# EAGLE design pcb_all (EAGLE 9.6.2)
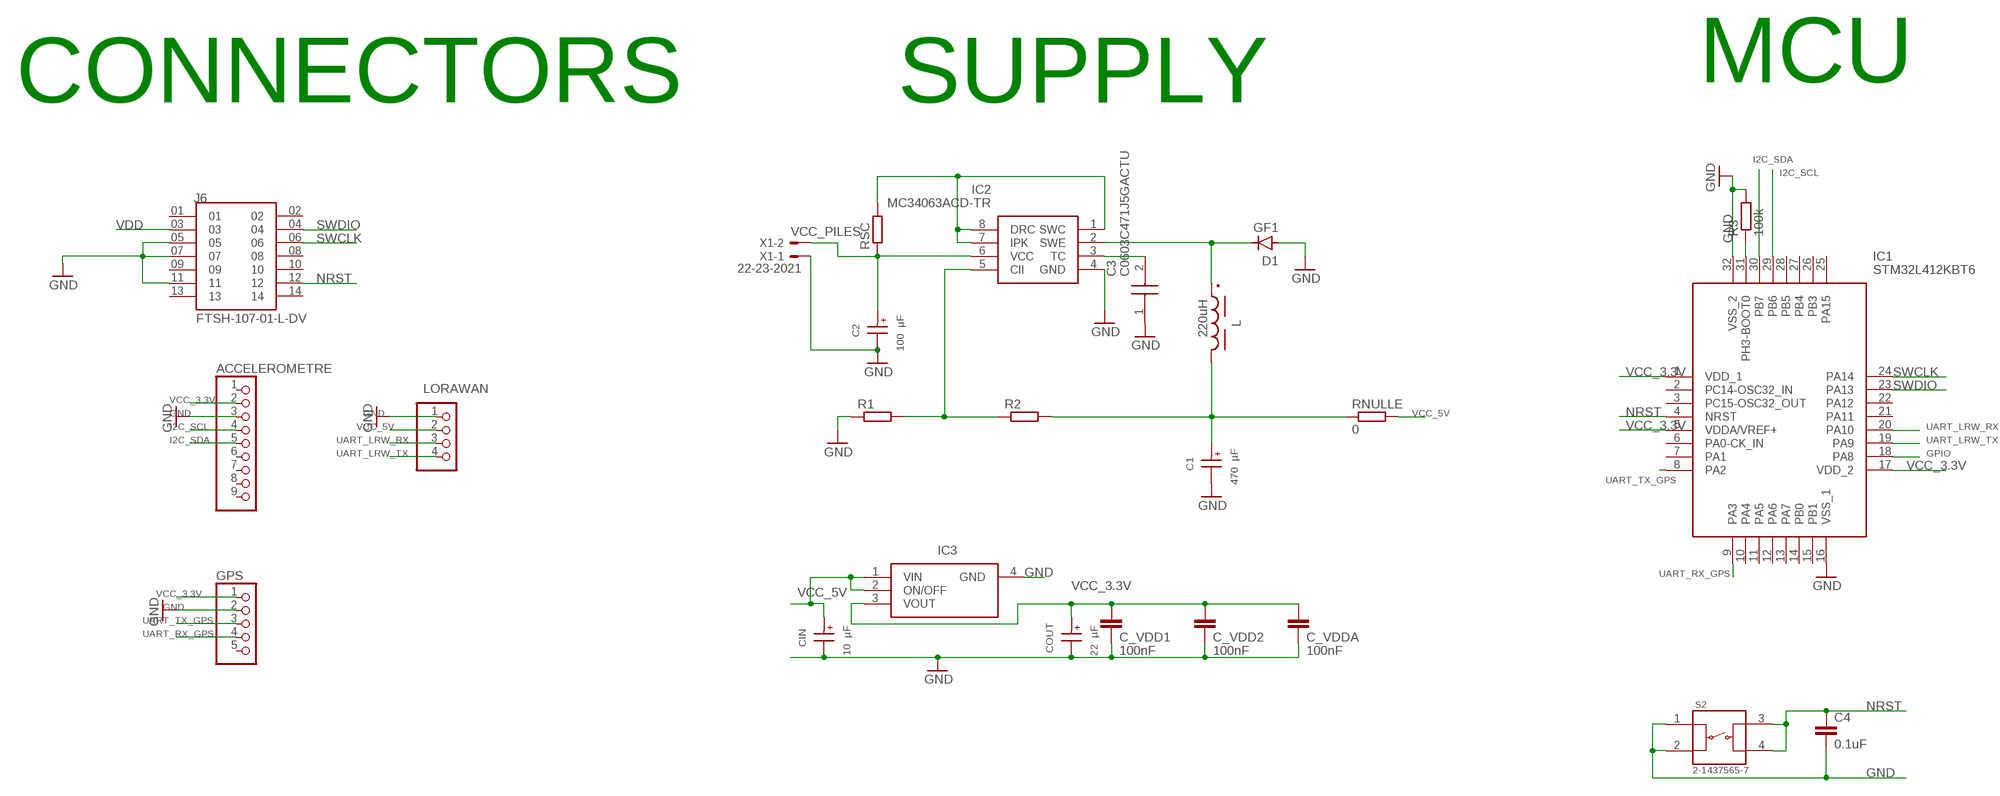
[diagram p0: schematic, sheet 1]

## Parts
ACCELEROMETRE  PINHD-1X9  [1X09]
C1  470 µF  WCAP-ASLL_8X10.5_865060353009  [WCAP-ASLL_8X10.5(DXL)]
C2  100 µF  WCAP-ASLL_6.3X7.7_865060445005  [WCAP-ASLL_6.3X7.7(DXL)]
C3  C0603C471J5GACTU  [C0603]
C4  0.1uF  C-EUC0603  [C0603]
C_VDD1  100nF  C-EUC0603  [C0603]
C_VDD2  100nF  C-EUC0603  [C0603]
C_VDDA  100nF  C-EUC0603  [C0603]
CIN  10 µF  WCAP-ASLL_4X5.5_865060440001  [WCAP-ASLL_4X5.5(DXL)]
COUT  22 µF  WCAP-ASLL_5X5.5_865060442002  [WCAP-ASLL_5X5.5(DXL)]
D1  GF1  [SMA-DO214AC]
GPS  PINHD-1X5  [1X05]
IC1  STM32L412KBT6  [QFP80P900X900X160-32N]
IC2  MC34063ACD-TR  [SOIC127P600X175-8N]
IC3  NCV33375ST3.3T3G  [SOT230P700X175-4N]
J6  FTSH-107-01-L-DV  [SAMTEC_FTSH-107-01-L-DV]
L  220uH  WE-PDA_1260_784771221  [WE-PDA_1260]
LORAWAN  PINHD-1X4  [1X04]
R1  R-EU_R0603  [R0603]
R2  R-EU_R0603  [R0603]
R3  100k  R-EU_R0603  [R0603]
RNULLE  0  R-EU_R0603  [R0603]
RSC  R-EU_R1206W  [R1206W]
S2  2-1437565-7  [SW_2-1437565-7]
X1  22-23-2021  [22-23-2021]

## Nets
GND: ACCELEROMETRE.3 C1.2(-) C2.2(-) C3.1 C4.2 C_VDD1.2 C_VDD2.2 C_VDDA.2 CIN.2(-) COUT.2(-) D1.A GPS.2 IC1.16(VSS_1) IC1.32(VSS_2) IC2.4(GND) IC3.4(GND) J6.05 J6.07 J6.11 LORAWAN.1 R1.1 R3.2 S2.1 S2.2 X1.1
GPIO: IC1.18(PA8)
I2C_SCL: ACCELEROMETRE.4 IC1.29(PB6)
I2C_SDA: ACCELEROMETRE.5 IC1.30(PB7)
N$1: C1.1(+) L.2 R2.2 RNULLE.1
N$2: IC2.1(SWC) IC2.7(IPK) IC2.8(DRC) RSC.2
N$3: IC2.5(CII) R1.2 R2.1
N$4: IC1.31(PH3-BOOT0) R3.1
N$6: D1.K(C) IC2.2(SWE) L.1
N$7: C3.2 IC2.3(TC)
NRST: C4.1 IC1.4(NRST) J6.12 S2.3 S2.4
SWCLK: IC1.24(PA14) J6.06
SWDIO: IC1.23(PA13) J6.04
UART_LRW_RX: IC1.20(PA10) LORAWAN.3
UART_LRW_TX: IC1.19(PA9) LORAWAN.4
UART_RX_GPS: GPS.4 IC1.9(PA3)
UART_TX_GPS: GPS.3 IC1.8(PA2)
VCC_3.3V: ACCELEROMETRE.2 C_VDD1.1 C_VDD2.1 C_VDDA.1 COUT.1(+) GPS.1 IC1.1(VDD_1) IC1.5(VDDA/VREF+) IC1.17(VDD_2) IC3.3(VOUT)
VCC_5V: CIN.1(+) IC3.1(VIN) IC3.2(ON/OFF) LORAWAN.2 RNULLE.2
VCC_PILES: C2.1(+) IC2.6(VCC) RSC.1 X1.2
VDD: J6.03
Unconnected: ACCELEROMETRE.1 ACCELEROMETRE.6 ACCELEROMETRE.7 ACCELEROMETRE.8 ACCELEROMETRE.9 GPS.5 IC1.2(PC14-OSC32_IN) IC1.3(PC15-OSC32_OUT) IC1.6(PA0-CK_IN) IC1.7(PA1) IC1.10(PA4) IC1.11(PA5) IC1.12(PA6) IC1.13(PA7) IC1.14(PB0) IC1.15(PB1) IC1.21(PA11) IC1.22(PA12) IC1.25(PA15) IC1.26(PB3) IC1.27(PB4) IC1.28(PB5) J6.01 J6.02 J6.08 J6.09 J6.10 J6.13 J6.14

## Notes on the sheet
- CONNECTORS | SUPPLY | MCU

## Library data of the parts
ACCELEROMETRE = pinhead:PINHD-1X9: PIN HEADER
C1 = C1:WCAP-ASLL_8X10.5: WCAP-ASLL Aluminium Electrolytic Capacitors Low Impedance & Long Life +105 °C Characteristics Low impedance and long life product series Mounting style: V-Chip SMT Capacitance range: 1 µF ‒ 6800 µF Capacitance tolerance: ±20 % Voltage range (UR): 6.3 ‒ 450 V(DC) Operating temperature: -55 °C up to +105 °C for UR ≤ 100 V(DC) -40 °C up to +105 °C for UR > 100 V(DC) Endurance: 2000 ‒ 5000 h @ +105 °C Dimensions (DxL) in mm: 4.0 x 5.5 up to 16.0 x 17.0 Recommended soldering: Reflow soldering Applications Long life application & low impedance Input and output capacitor for switched-mode power supply Filtering Smoothing e.g. DC/DC converter, AC/DC converter, satellite receiver, control panel <https://www.we-online.com/catalog/media/o14724v209%20Family_WCAP-ASLL.jpg> Details see: https://www.we-online.com/catalog/en/WCAP-ASLL/ Updated by yingchun,Shan;2020-03-03 2020(C) Würth Elektronik; DATASHEET-URL: https://www.we-online.com/catalog/datasheet/865060353009.pdf; DF: 16%; DIAMETER: 8mm; I-LEAK: 75.2uA; I-RIPPLE: 600mA; L: 10.5mm; OPERATING-TEMPERATURE: -55 °C up to +105 °C; PART-NUMBER: 865060353009; TECHNICAL-REFERENCE: ASEE105471M016DVCTEE000; VR: 16V(DC); Z: 0.17Ohm
C2 = C2:WCAP-ASLL_6.3X7.7: WCAP-ASLL Aluminium Electrolytic Capacitors Low Impedance & Long Life +105 °C Characteristics Low impedance and long life product series Mounting style: V-Chip SMT Capacitance range: 1 µF ‒ 6800 µF Capacitance tolerance: ±20 % Voltage range (UR): 6.3 ‒ 450 V(DC) Operating temperature: -55 °C up to +105 °C for UR ≤ 100 V(DC) -40 °C up to +105 °C for UR > 100 V(DC) Endurance: 2000 ‒ 5000 h @ +105 °C Dimensions (DxL) in mm: 4.0 x 5.5 up to 16.0 x 17.0 Recommended soldering: Reflow soldering Applications Long life application & low impedance Input and output capacitor for switched-mode power supply Filtering Smoothing e.g. DC/DC converter, AC/DC converter, satellite receiver, control panel <https://www.we-online.com/catalog/media/o14724v209%20Family_WCAP-ASLL.jpg> Details see: https://www.we-online.com/catalog/en/WCAP-ASLL/ Updated by yingchun,Shan;2020-03-03 2020(C) Würth Elektronik; DATASHEET-URL: https://www.we-online.com/catalog/datasheet/865060445005.pdf; DF: 14%; DIAMETER: 6.3mm; I-LEAK: 25uA; I-RIPPLE: 300mA; L: 7.7mm; OPERATING-TEMPERATURE: -55 °C up to +105 °C; PART-NUMBER: 865060445005; TECHNICAL-REFERENCE: ASED077101M025DVCTCB000; VR: 25V(DC); Z: 0.36Ohm
C3 = C0603C471J5GACTU:C0603C471J5GACTU: SMD Comm C0G, Ceramic, 470 pF, 5%, 50 VDC, 125 VDC, 125?C, -55?C, C0G, SMD, MLCC, Ultra-Stable, Low Loss, Class I, 0.1 % , 100 GOhms, 3.7 mg, 0603, 1.6mm, 0.8mm, 0.8mm, 0.7mm, 0.35mm, 4000, 78 Weeks, 120 Source: Datasheet <https://content.kemet.com/datasheets/KEM_C1003_C0G_SMD.pdf>; ARROW_PART_NUMBER: C0603C471J5GACTU; ARROW_PRICE-STOCK: https://www.arrow.com/en/products/c0603c471j5gactu/kemet-corporation?region=nac; DESCRIPTION: SMD Comm C0G, Ceramic, 470 pF, 5%, 50 VDC, 125 VDC, 125?C, -55?C, C0G, SMD, MLCC, Ultra-Stable, Low Loss, Class I, 0.1 % , 100 GOhms, 3.7 mg, 0603, 1.6mm, 0.8mm, 0.8mm, 0.7mm, 0.35mm, 4000, 78 Weeks, 120; HEIGHT: 0.87mm; MANUFACTURER_NAME: KEMET; MANUFACTURER_PART_NUMBER: C0603C471J5GACTU; MOUSER_PART_NUMBER: 80-C0603C471J5G; MOUSER_PRICE-STOCK: https://www.mouser.co.uk/ProductDetail/KEMET/C0603C471J5GACTU?qs=6Zy9Yzz7FWCvDjERNKhvPg%3D%3D
C4 C_VDD1 C_VDD2 C_VDDA = rcl:C-EU: CAPACITOR, European symbol; SPICEPREFIX: C
CIN = Cin:WCAP-ASLL_4X5.5: WCAP-ASLL Aluminium Electrolytic Capacitors Low Impedance & Long Life +105 °C Characteristics Low impedance and long life product series Mounting style: V-Chip SMT Capacitance range: 1 µF ‒ 6800 µF Capacitance tolerance: ±20 % Voltage range (UR): 6.3 ‒ 450 V(DC) Operating temperature: -55 °C up to +105 °C for UR ≤ 100 V(DC) -40 °C up to +105 °C for UR > 100 V(DC) Endurance: 2000 ‒ 5000 h @ +105 °C Dimensions (DxL) in mm: 4.0 x 5.5 up to 16.0 x 17.0 Recommended soldering: Reflow soldering Applications Long life application & low impedance Input and output capacitor for switched-mode power supply Filtering Smoothing e.g. DC/DC converter, AC/DC converter, satellite receiver, control panel <https://www.we-online.com/catalog/media/o14724v209%20Family_WCAP-ASLL.jpg> Details see: https://www.we-online.com/catalog/en/WCAP-ASLL/ Updated by yingchun,Shan;2020-03-03 2020(C) Würth Elektronik; DATASHEET-URL: https://www.we-online.com/catalog/datasheet/865060440001.pdf; DF: 14%; DIAMETER: 4mm; I-LEAK: 3uA; I-RIPPLE: 90mA; L: 5.5mm; OPERATING-TEMPERATURE: -55 °C up to +105 °C; PART-NUMBER: 865060440001; TECHNICAL-REFERENCE: ASEB055100M025DVCTAB000; VR: 25V(DC); Z: 1.35Ohm
COUT = Cout:WCAP-ASLL_5X5.5: WCAP-ASLL Aluminium Electrolytic Capacitors Low Impedance & Long Life +105 °C Characteristics Low impedance and long life product series Mounting style: V-Chip SMT Capacitance range: 1 µF ‒ 6800 µF Capacitance tolerance: ±20 % Voltage range (UR): 6.3 ‒ 450 V(DC) Operating temperature: -55 °C up to +105 °C for UR ≤ 100 V(DC) -40 °C up to +105 °C for UR > 100 V(DC) Endurance: 2000 ‒ 5000 h @ +105 °C Dimensions (DxL) in mm: 4.0 x 5.5 up to 16.0 x 17.0 Recommended soldering: Reflow soldering Applications Long life application & low impedance Input and output capacitor for switched-mode power supply Filtering Smoothing e.g. DC/DC converter, AC/DC converter, satellite receiver, control panel <https://www.we-online.com/catalog/media/o14724v209%20Family_WCAP-ASLL.jpg> Details see: https://www.we-online.com/catalog/en/WCAP-ASLL/ Updated by yingchun,Shan;2020-03-03 2020(C) Würth Elektronik; DATASHEET-URL: https://www.we-online.com/catalog/datasheet/865060442002.pdf; DF: 14%; DIAMETER: 5mm; I-LEAK: 5.5uA; I-RIPPLE: 150mA; L: 5.5mm; OPERATING-TEMPERATURE: -55 °C up to +105 °C; PART-NUMBER: 865060442002; TECHNICAL-REFERENCE: ASEC055220M025DVCTBB000; VR: 25V(DC); Z: 0.8Ohm
D1 = diode:GF1: DIODE
GPS = pinhead:PINHD-1X5: PIN HEADER
IC1 = STM32_librairy:STM32L412KBT6: ARM Microcontrollers - MCU Ultra-low-power Arm Cortex -M4 32-bit MCU+FPU, 100DMIPS up to 128KB Flash, 40KB SRAM, analog, ext. SMPS Source: Datasheet; DESCRIPTION: ARM Microcontrollers - MCU Ultra-low-power Arm Cortex -M4 32-bit MCU+FPU, 100DMIPS up to 128KB Flash, 40KB SRAM, analog, ext. SMPS; HEIGHT: 1.6mm; MANUFACTURER_NAME: STMicroelectronics; MANUFACTURER_PART_NUMBER: STM32L412KBT6; MOUSER_PART_NUMBER: 511-STM32L412KBT6; MOUSER_PRICE-STOCK: https://www.mouser.co.uk/ProductDetail/STMicroelectronics/STM32L412KBT6?qs=%252BEew9%252B0nqrD6o08jV%2F00TA%3D%3D
IC2 = SamacSys_Parts:MC34063ACD-TR: MC34063ACD-TR, DC-DC Controller, 40 V, 8-Pin, SOIC Source: Datasheet <http://www.st.com/st-web-ui/static/active/en/resource/technical/document/datasheet/CD00001232.pdf>; DESCRIPTION: MC34063ACD-TR, DC-DC Controller, 40 V, 8-Pin, SOIC; HEIGHT: 1.75mm; MANUFACTURER_NAME: STMicroelectronics; MANUFACTURER_PART_NUMBER: MC34063ACD-TR; MOUSER_PART_NUMBER: 511-MC34063ACD-TR; MOUSER_PRICE-STOCK: https://www.mouser.co.uk/ProductDetail/STMicroelectronics/MC34063ACD-TR?qs=zDcCjb1ShEnlEhOFqqejBw%3D%3D
IC3 = SamacSys_Parts:NCV33375ST3.3T3G: ON SEMICONDUCTOR - NCV33375ST3.3T3G - Fixed LDO Voltage Regulator, 4.3V to 13V, 260mV Dropout, 3.3Vout, 300mAout, SOT-223-4 Source: Datasheet <http://www.onsemi.com/pub/Collateral/MC33375-D.PDF>; DESCRIPTION: ON SEMICONDUCTOR - NCV33375ST3.3T3G - Fixed LDO Voltage Regulator, 4.3V to 13V, 260mV Dropout, 3.3Vout, 300mAout, SOT-223-4; HEIGHT: 1.75mm; MANUFACTURER_NAME: onsemi; MANUFACTURER_PART_NUMBER: NCV33375ST3.3T3G; MOUSER_PART_NUMBER: 863-NCV33375ST3.3T3G; MOUSER_PRICE-STOCK: https://www.mouser.co.uk/ProductDetail/ON-Semiconductor/NCV33375ST33T3G?qs=Pqj8oIac8rWOl%252BM3OwXrOg%3D%3D
J6 = FTSH-107-01-L-DV:FTSH-107-01-L-DV; MANUFACTURER: Samtec; PARTREV: R; STANDARD: Manufacturer Recommendations
L = L:WE-PDA_1260: WE-PDA SMD Shielded Power Inductor Characteristics Magnetically shielded version which results in a low leakage field High storage capacity High Saturation currents up to 23 A Very low self-losses at high switching frequency's Wide inductance spectrum available at all sizes Operating Temperature -40 °C up to +125 °C Core Material: NiZn Wire connection: welding technology Applications Multimedia applications Switching regulators with low operating voltages Integrated DC/DC-converter Perfect suitable for switching regulators with extremely high efficiency (> 86 %) Plastic base: Because of the one piece construction these are more suitable for high vibration or shock applications <https://www.we-online.com/catalog/media/o55118v209%20Family_WE-PDA.jpg> Details see: https://www.we-online.com/katalog/en/WE-PDA Updated by Ella Wu 2020-03-18 2020(C) Wurth Elektronik; DATASHEET-URL: https://www.we-online.com/catalog/datasheet/784771221.pdf; FRES: 3.9MHz; IR: 0.99A; ISAT: 1.1A; MOUNT: SMT; PART-NUMBER: 784771221; RDC-MAX: 348mOhm; RDC-TYP: 290mOhm
LORAWAN = pinhead:PINHD-1X4: PIN HEADER
R1-R3 RNULLE RSC = rcl:R-EU_: RESISTOR, European symbol; SPICEPREFIX: R
S2 = 2-1437565-7:2-1437565-7: FSM2JSMA=SMT,TACTILE,PB SWITCH Check availability <https://pricing.snapeda.com/parts/FSM2JSMA/TE%20Connectivity/view-part?ref=eda>; AVAILABILITY: In Stock; COMMENT: 2-1437565-7; CONFIGURATION_POLE-THROW: Single Pole - Single Throw; CONTACT_CURRENT_RATING: 50 mA; DESCRIPTION: Tactile Switch SPST-NO Top Actuated Surface Mount; MF: TE Connectivity; MP: FSM2JSMA; PACKAGE: None; PRICE: None; PURCHASE-URL: https://pricing.snapeda.com/search/part/FSM2JSMA/?ref=eda
X1 = con-molex:22-23-2021: .100" (2.54mm) Center Header - 2 Pin; MF: MOLEX; MPN: 22-23-2021; OC_FARNELL: 1462926; OC_NEWARK: 25C3832

## Board
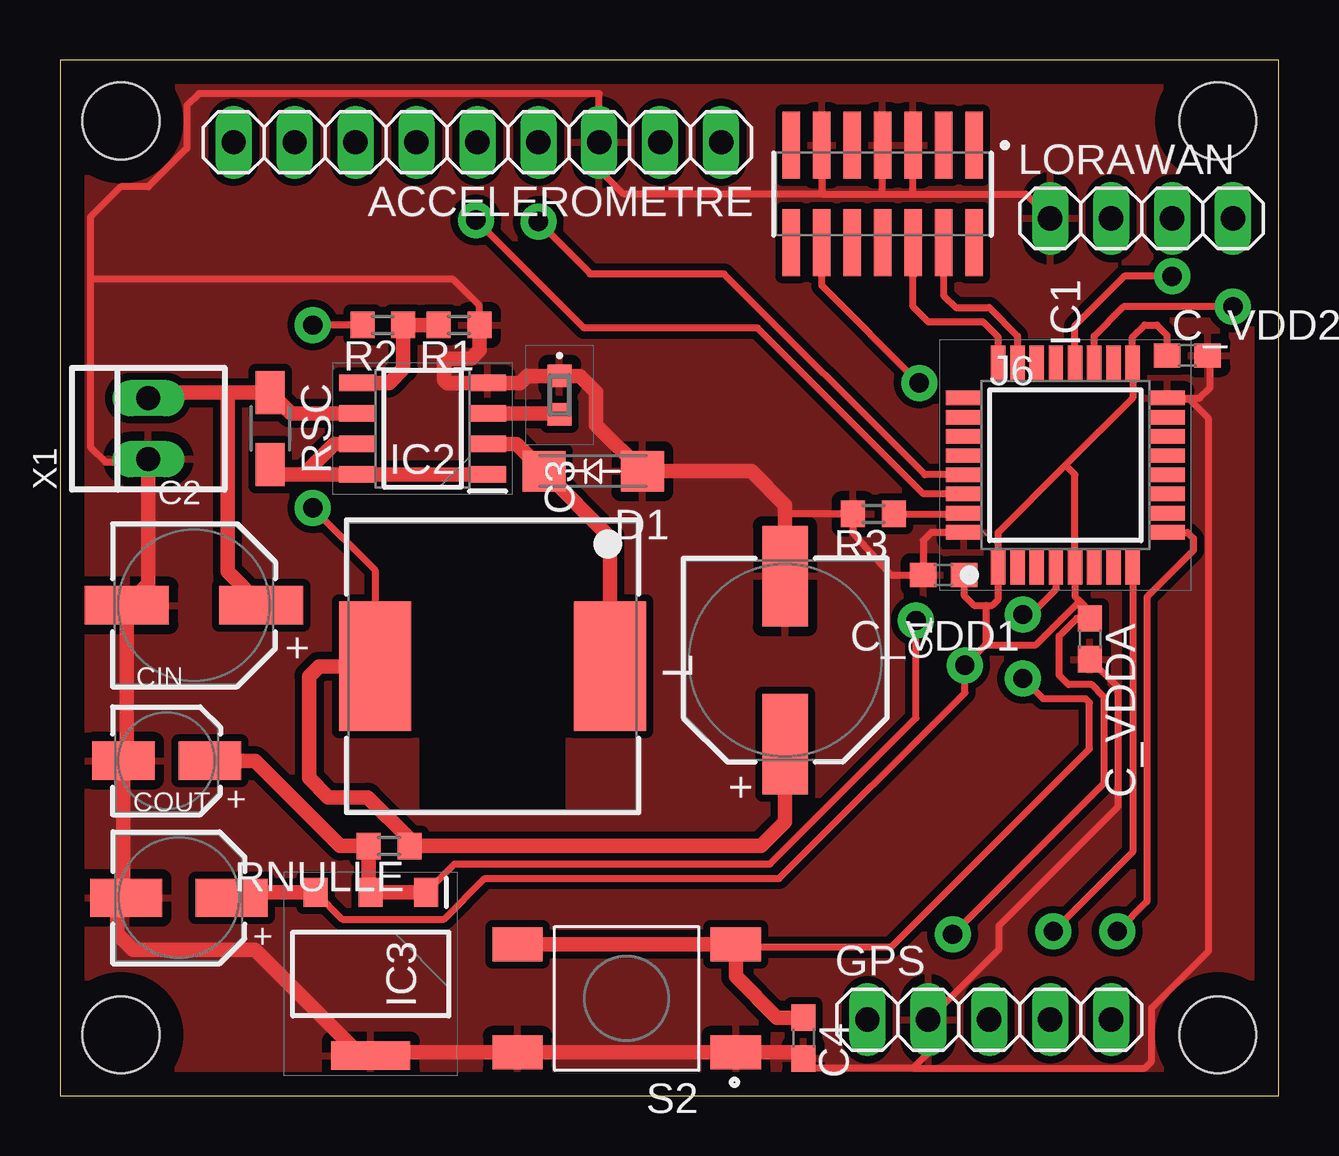
[diagram p1: board, top side]
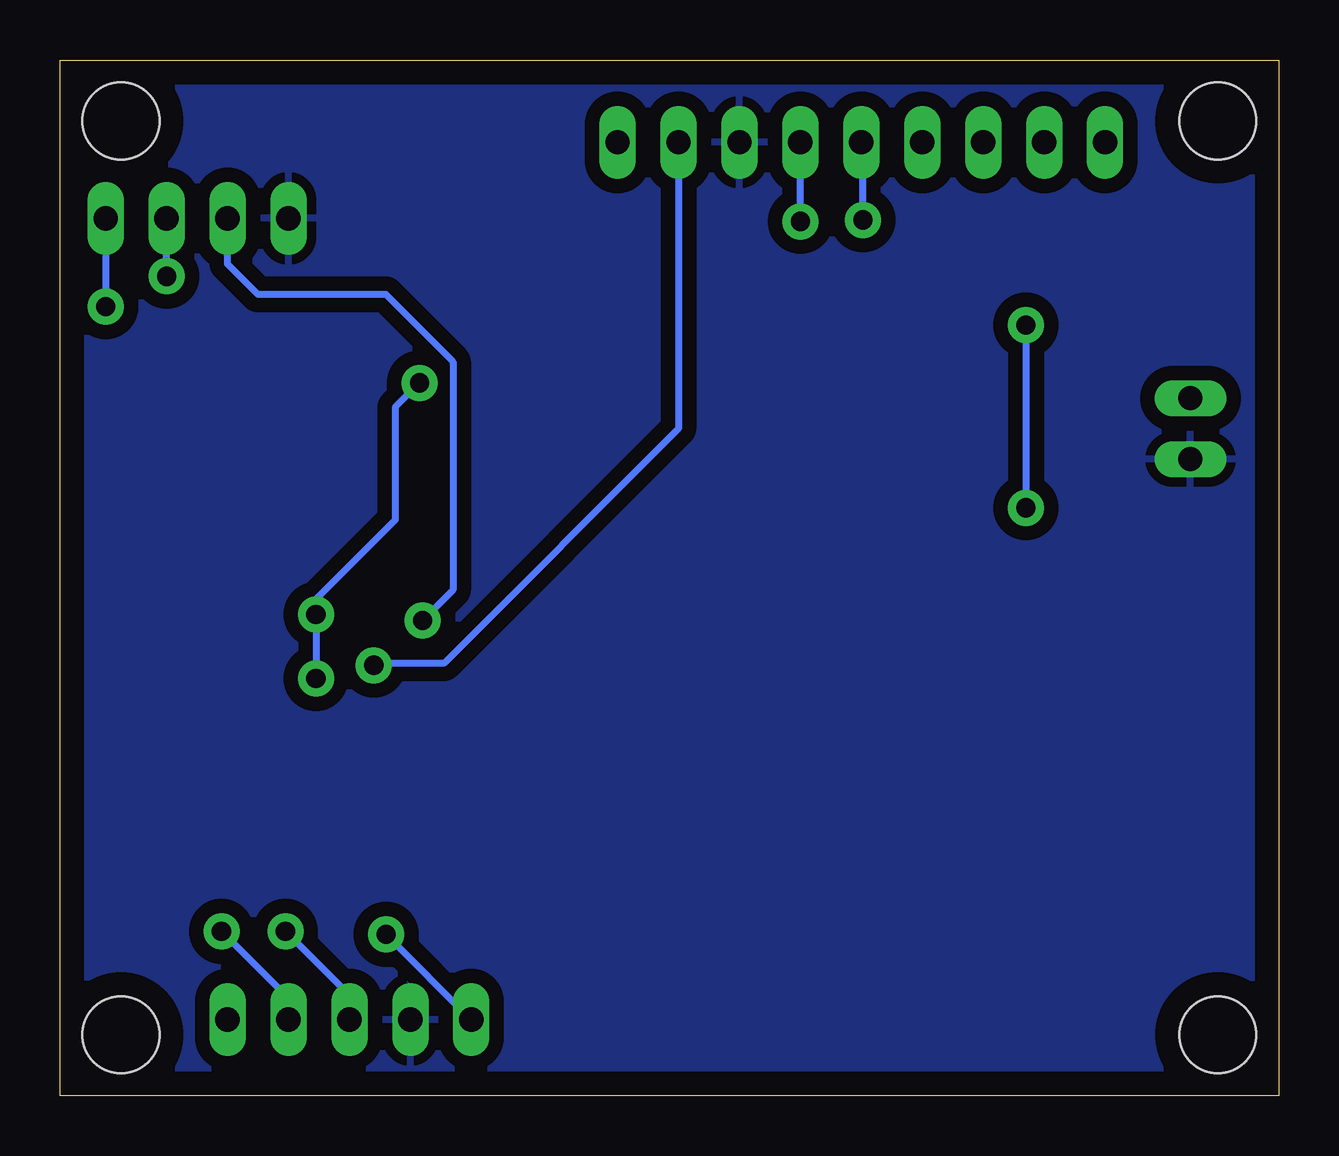
[diagram p2: board, bottom side, seen from below]

Size 50.8 x 43.18 mm. Coordinates in mm from the lower left corner, seen from the top.
Outline: 0,0 50.8,0 50.8,43.18 0,43.18 0,0
Copper layers (1*16): Top 0.035mm / dielectric 1.5mm / Bottom 0.035mm
Design rules "ENSEA_2022_04_08 *": minimum track width 0.2mm, minimum drill 0.6mm, track to track 0.3mm, track to pad 0.3mm, pad to pad 0.3mm, via to via 0.3mm, smd to smd 0.3mm, copper to edge 1mm, drill to drill 0.4mm, minimum pad ring 0.2mm, minimum via ring 0.2mm, stop-mask expansion 4mil, vias tented up to drill 0mil, thermal gap 0.4mm
Holes 3.2 mm at 2.54,2.54 2.54,40.64 48.26,2.54 48.26,40.64

### Footprints (pad centres in the part's own frame; a part is rotated, then mirrored left to right if it is on the bottom)
1X09 = drill 1.016 long: 1 -10.16,0; 2 -7.62,0; 3 -5.08,0; 4 -2.54,0; 5 0,0; 6 2.54,0; 7 5.08,0; 8 7.62,0; 9 10.16,0
WCAP-ASLL_8X10.5(DXL) = smd 4.2 x 1.9: 1 3.5,0; 2 -3.5,0
WCAP-ASLL_6.3X7.7(DXL) = smd 3.5 x 1.6: 1 2.8,0; 2 -2.8,0
C0603 = smd 0.95 x 1: 1 -0.8,0; 2 0.8,0
C0603' = smd 1.1 x 1: 1 -0.85,0; 2 0.85,0
WCAP-ASLL_4X5.5(DXL) = smd 2.6 x 1.6: 1 1.8,0; 2 -1.8,0
WCAP-ASLL_5X5.5(DXL) = smd 3 x 1.6: 1 2.2,0; 2 -2.2,0
SMA-DO214AC = smd 1.8 x 1.7: A -2.05,0; K 2.05,0
1X05 = drill 1.016 long: 1 -5.08,0; 2 -2.54,0; 3 0,0; 4 2.54,0; 5 5.08,0
QFP80P900X900X160-32N = smd 1.475 x 0.6: 1 -4.238,2.8; 2 -4.238,2; 3 -4.238,1.2; 4 -4.238,0.4; 5 -4.238,-0.4; 6 -4.238,-1.2; 7 -4.238,-2; 8 -4.238,-2.8; 17 4.238,-2.8; 18 4.238,-2; 19 4.238,-1.2; 20 4.238,-0.4; 21 4.238,0.4; 22 4.238,1.2; 23 4.238,2; 24 4.238,2.8 | smd 0.6 x 1.475: 9 -2.8,-4.238; 10 -2,-4.238; 11 -1.2,-4.238; 12 -0.4,-4.238; 13 0.4,-4.238; 14 1.2,-4.238; 15 2,-4.238; 16 2.8,-4.238; 25 2.8,4.238; 26 2,4.238; 27 1.2,4.238; 28 0.4,4.238; 29 -0.4,4.238; 30 -1.2,4.238; 31 -2,4.238; 32 -2.8,4.238
SOIC127P600X175-8N = smd 1.525 x 0.7: 1 -2.712,1.905; 2 -2.712,0.635; 3 -2.712,-0.635; 4 -2.712,-1.905; 5 2.712,-1.905; 6 2.712,-0.635; 7 2.712,0.635; 8 2.712,1.905
SOT230P700X175-4N = smd 1.2 x 1: 1 -3.4,2.3; 2 -3.4,0; 3 -3.4,-2.3 | smd 1.2 x 3.3: 4 3.4,0
SAMTEC_FTSH-107-01-L-DV = smd 0.74 x 2.79: 01 -3.81,-2.035; 02 -3.81,2.035; 03 -2.54,-2.035; 04 -2.54,2.035; 05 -1.27,-2.035; 06 -1.27,2.035; 07 0,-2.035; 08 0,2.035; 09 1.27,-2.035; 10 1.27,2.035; 11 2.54,-2.035; 12 2.54,2.035; 13 3.81,-2.035; 14 3.81,2.035
WE-PDA_1260 = smd 5.4 x 3: 1 0,4.9; 2 0,-4.9
1X04 = drill 1.016 long: 1 -3.81,0; 2 -1.27,0; 3 1.27,0; 4 3.81,0
R0603 = smd 1 x 1.1: 1 -0.85,0; 2 0.85,0
R1206W = smd 1.8 x 1.2: 1 -1.499,0; 2 1.499,0
SW_2-1437565-7 = smd 2.1 x 1.4: 1 -4.55,2.25; 2 4.55,2.25; 3 -4.55,-2.25; 4 4.55,-2.25
22-23-2021 = drill 1 long: 1 -1.27,0; 2 1.27,0

### Placement (x,y rotation side)
ACCELEROMETRE  17.4,39.75 180 top
C1  30.23,18.16 270 top
C2  5.59,20.45 0 top
C3  20.83,29.21 270 top
C4  0.1uF  [C0603']  30.99,2.41 270 top
C_VDD1  100nF  [C0603']  36.83,21.72 180 top
C_VDD2  100nF  [C0603']  46.99,30.86 0 top
C_VDDA  100nF  [C0603']  42.93,19.05 270 top
CIN  4.45,13.97 0 top
COUT  4.95,8.26 0 top
D1  22.23,26.04 180 top
GPS  38.73,3.17 0 top
IC1  41.91,26.29 90 top
IC2  15.11,27.81 180 top
IC3  12.95,5.08 270 top
J6  34.29,37.59 180 top
L  18.03,17.91 270 top
LORAWAN  45.09,36.58 0 top
R1  16.64,32.13 180 top
R2  13.46,32.13 180 top
R3  33.91,24.26 180 top
RNULLE  13.72,10.41 180 top
RSC  8.76,27.81 270 top
S2  23.62,4.06 180 top
X1  3.68,27.81 90 top

### Tracks (layer width: path | path; a pad name or v marks a point on that pad's centre or on a via)
GND
  Top 0.3: IC1.32 36.32,23.49 35.98,23.15 C_VDD1.2 34.64,21.72 33.06,23.46 R3.2 30.23,24.26 | C_VDD2.2 47.94,30.76 47.94,29.53 47.5,29.08 47.49,29.09 IC1.16 46.2,29.04 47.07,29.04 47.88,28.23 47.88,6.05 45.51,3.68 45.51,1.44 45.22,1.15 35.56,1.15 | X1.1 3.56,26.42 1.91,26.42 1.27,27.05 1.27,34.04 | 1.27,34.04 1.27,36.62 2.54,37.89 3.68,37.89 5.29,39.5 5.29,41.27 5.8,41.78 22.48,41.78 ACCELEROMETRE.3 22.48,38.61 23.5,37.59 31.75,37.59 | R1.1 17.49,32.93 16.38,34.04 1.27,34.04 | J6.11 31.75,37.59 | 31.75,37.59 34.29,37.59 | 34.29,37.59 J6.07 | 34.29,37.59 35.56,37.59 | 35.56,37.59 J6.05 | 35.56,1.15 36.2,1.78 GPS.2 39.15,6.13 39.15,7.11 44.11,12.07 44.11,17.02 C_VDDA.2 | 35.56,1.15 31.4,1.15 C4.2 | 35.56,37.59 40.26,37.59 LORAWAN.1
  Top 0.6: X1.1 3.68,21.34 C2.2 2.79,14.11 CIN.2 2.65,8.36 COUT.2 2.39,8.62 2.39,6.75 3.05,6.1 8.13,6.1 12.54,1.68 IC3.4 13.09,1.81 S2.2 S2.1 30.74,1.81 C4.2 | R1.1 17.49,31.08 17.14,30.73 16.13,30.73 16,30.61 16,29.84 16.13,29.72 IC2.4 19.18,29.72 19.47,30.01 C3.1 21.68,30.01 22.35,29.34 22.35,27.96 D1.A 28.83,26.04 30.23,24.64 30.23,24.26 C1.2
  pour Top: 0,0 50.8,0 50.8,43.18 0,43.18
  pour Bottom (isolate 0.6): 0,0 0,43.18 50.8,43.18 50.8,0
I2C_SCL  (via drill 0.8 pad 1.5)
  Top 0.3: IC1.29 36.05,25.89 27.68,34.26 22.09,34.26 22.09,34.3 v19.94,36.45
  Bottom 0.3: v19.94,36.45 ACCELEROMETRE.4
I2C_SDA  (via drill 0.8 pad 1.5)
  Top 0.3: IC1.30 36,25.09 29.08,32 21.84,32 v17.34,36.51
  Bottom 0.2: 17.34,39.69 ACCELEROMETRE.5
  Bottom 0.3: v17.34,36.51 17.34,39.69
N$1  (via drill 0.8 pad 1.5)
  Top 0.3: R2.2 v10.54,32.13 | v10.54,24.51 13.13,21.92 L.2
  Top 0.6: L.2 10.79,17.91 10.38,17.49 10.38,13.25 11.18,12.45 12.83,12.45 14.57,10.71 RNULLE.1 29.21,10.41 30.23,11.43 C1.1
  Bottom 0.3: v10.54,32.13 v10.54,24.51
N$2
  Top 0.6: 10.16,25.91 IC2.8 IC2.1 | 10.16,25.91 9.17,25.91 RSC.2 | IC2.7 11.43,27.18 10.16,25.91
N$3
  Top 0.6: IC2.5 13.72,29.72 14.31,30.31 R2.1 R1.2
N$4
  Top 0.3: R3.1 37.64,24.26 IC1.31
N$6
  Top 0.6: IC2.2 19.03,27.18 D1.K 22.93,23.28 L.1
N$7
  Top 0.6: IC2.3 20.79,28.45 C3.2
NRST  (via drill 0.8 pad 1.5)
  Top 0.3: v35.81,29.72 31.75,33.78 J6.12 | v40.13,17.4 40.99,16.55 42.75,16.55 42.91,16.39 42.91,14.47 34.63,6.19 28.3,6.19 S2.3 | IC1.4 41.51,21.1 40.48,20.07 v40.13,20.07
  Top 0.6: C4.1 29.88,3.26 28.17,4.97 S2.3 S2.4
  Bottom 0.3: v35.81,29.72 36.83,28.7 36.83,24 40.13,20.7 v40.13,20.07 v40.13,17.4
SWCLK
  Top 0.3: IC1.24 39.11,31.63 38.48,32.26 36.2,32.26 35.56,32.89 35.56,34.16 35.56,34.92 J6.06
SWDIO
  Top 0.3: J6.04 36.83,33.37 37.34,32.86 38.73,32.86 39.91,31.68 IC1.23
UART_LRW_RX  (via drill 0.8 pad 1.5)
  Top 0.3: IC1.20 42.31,32.11 44.36,34.16 v46.35,34.16
  Bottom 0.3: v46.35,34.16 LORAWAN.3
UART_LRW_TX  (via drill 0.8 pad 1.5)
  Top 0.3: IC1.19 43.11,31.68 44.32,32.89 v48.9,32.89
  Bottom 0.3: LORAWAN.4 v48.9,32.89
UART_RX_GPS  (via drill 0.8 pad 1.5)
  Top 0.3: IC1.9 47,23.49 47.24,23.24 47.24,22.73 45.31,20.8 45.31,8.1 v44.07,6.86
  Bottom 0.2: 41.15,3.3 GPS.4
  Bottom 0.3: v44.07,6.86 41.15,3.94 41.15,3.3
UART_TX_GPS  (via drill 0.8 pad 1.5)
  Top 0.3: IC1.8 44.71,10.17 v41.4,6.86
  Bottom 0.3: v41.4,6.86 38.73,4.19 GPS.3
VCC_3.3V  (via drill 0.8 pad 1.5)
  Top 0.3: C_VDD1.1 37.68,20.87 38.1,20.45 38.61,20.45 | 38.61,20.45 38.86,20.45 39.11,20.7 IC1.1 39.11,23.49 41.91,26.29 | 42.5,20.62 42.31,20.81 IC1.5 42.31,25.89 41.91,26.29 | 42.5,20.62 42.93,20.19 C_VDDA.1 42.38,19.9 41.66,19.18 41.66,17.53 42.04,17.14 43,17.14 43.51,16.64 43.51,13.03 v37.21,6.73 | C_VDD2.1 46.14,31.71 45.72,32.13 45.21,32.13 44.7,31.62 IC1.17 44.71,29.09 41.91,26.29 | 38.61,18.8 40.68,18.8 42.5,20.62 | IC3.3 11.77,7.37 16,7.37 17.7,9.06 29.98,9.06 37.72,16.8 v37.72,17.95 38.57,18.8 38.61,18.8 | 38.61,18.8 38.61,20.45
  Top 0.6: COUT.1 7.38,8.48 IC3.3
  Bottom 0.3: ACCELEROMETRE.2 25.02,27.81 34.8,18.03 37.72,18.03 v37.72,17.95 | v37.21,6.73 GPS.1
VCC_5V  (via drill 0.8 pad 1.5)
  Top 0.3: IC3.1 16.44,9.66 29.6,9.66 35.69,15.75 v35.69,19.81
  Top 0.6: CIN.1 8.13,13.97 11.68,10.41 RNULLE.2 12.87,8.57 IC3.2 IC3.1
  Bottom 0.3: v35.69,19.81 34.42,21.08 34.42,30.61 37.21,33.4 42.55,33.4 43.81,34.67 LORAWAN.2
VCC_PILES
  Top 0.6: X1.2 3.91,29.31 6.99,29.31 | 6.99,29.31 RSC.1 9.63,28.45 IC2.6 | C2.1 6.99,21.85 6.99,29.31